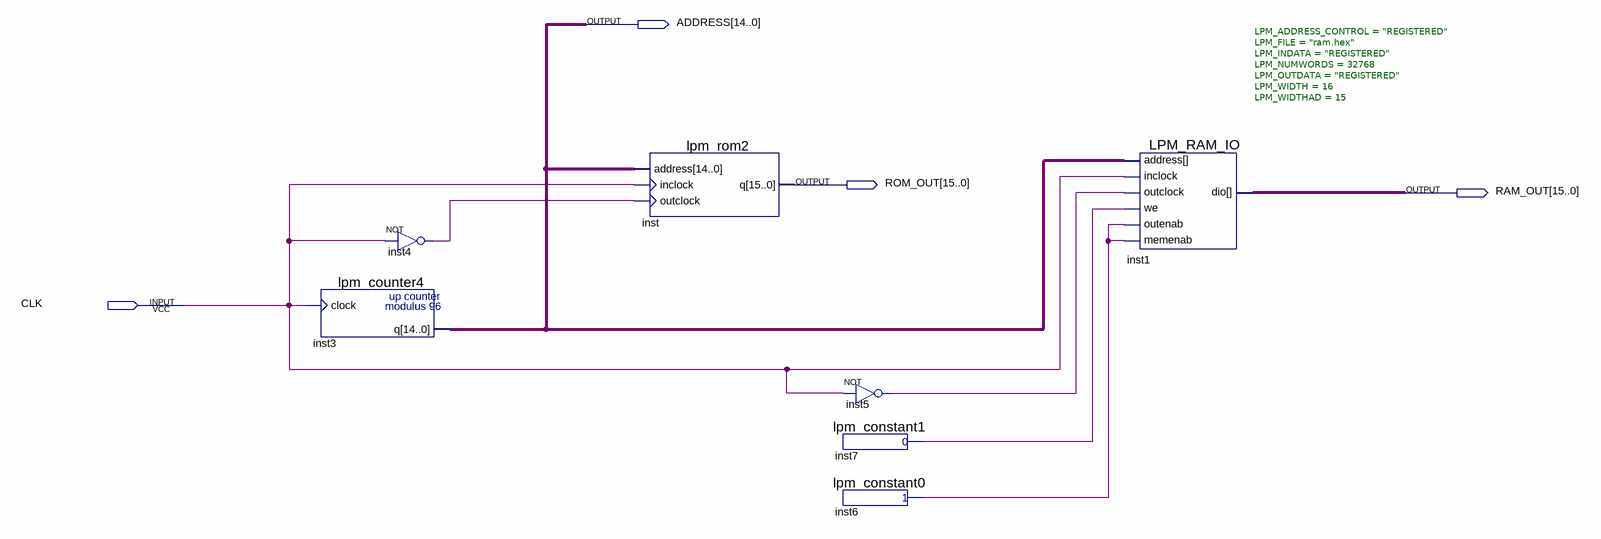
[diagram p0: schematic sheet]
// Quartus schematic ROM_RAM_ForwardingTest.bdf as structural Verilog: 7 symbols, 4 pins
module ROM_RAM_ForwardingTest (
  input  CLK,
  output [14:0] ADDRESS,
  output [15:0] ROM_OUT,
  output [15:0] RAM_OUT
);

  wire inst4_out, inst5_out, inst6_result, inst7_result;

  lpm_counter4 inst3 (.clock(CLK), .q(ADDRESS));
  not inst4 (inst4_out, CLK);
  lpm_rom2 inst (.address(ADDRESS), .inclock(CLK), .outclock(inst4_out), .q(ROM_OUT));
  not inst5 (inst5_out, CLK);
  lpm_constant1 inst7 (.result(inst7_result));
  lpm_constant0 inst6 (.result(inst6_result));
  LPM_RAM_IO #(.LPM_ADDRESS_CONTROL("REGISTERED"), .LPM_FILE("ram.hex"), .LPM_INDATA("REGISTERED"), .LPM_NUMWORDS(32768), .LPM_OUTDATA("REGISTERED"), .LPM_WIDTH(16), .LPM_WIDTHAD(15)) inst1 (
    .address(ADDRESS), .outclock(inst5_out), .memenab(inst6_result), .inclock(CLK), .we(inst7_result),
    .outenab(inst6_result), .dio(RAM_OUT));
endmodule
